# Altium project TS4994_Add_on_v1.PrjPcb
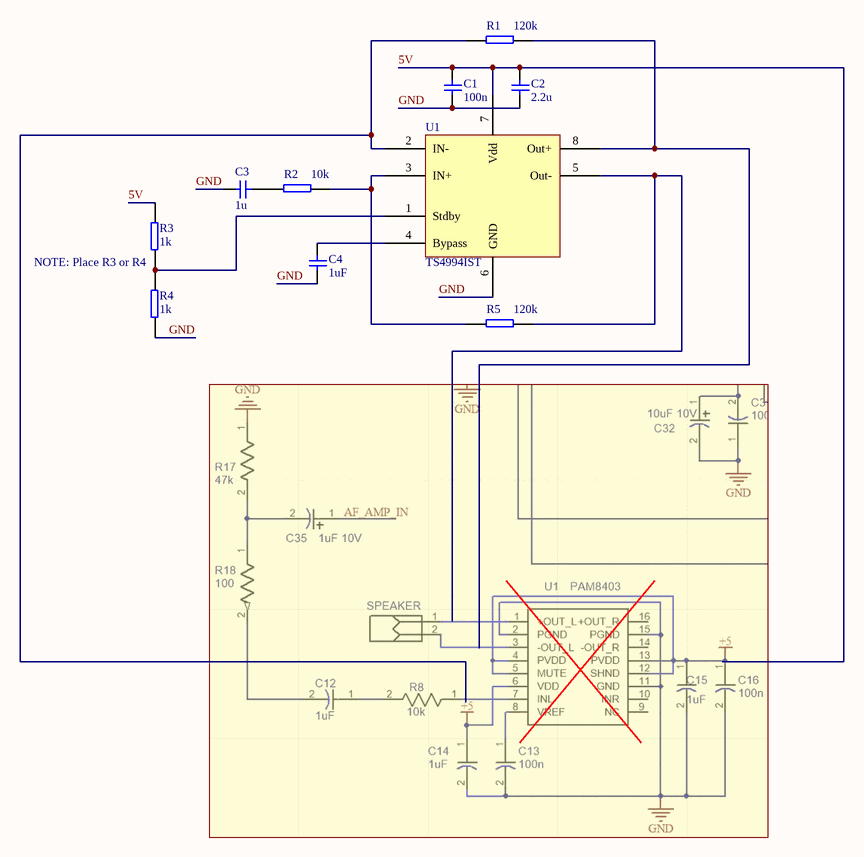
[diagram p0: TS4994_Add_on_v1.SchDoc]
1 sheet, 10 parts. Net scope: hierarchical (ports join the sheet entries above them; power ports are global).
Board file: TS4994_Add_on_v1.PcbDoc

## Sheet TS4994_Add_on_v1.SchDoc
size A4

### Parts
C1  value 100n  [0805S]  (hidden comment: C0805)
C2  value 2.2u  [0805S]  (hidden comment: C0805)
C3  value 1u  [0805S]  (hidden comment: C0805)
C4  value 1uF  [0805S]  (hidden comment: C0805)
R1  value 120k  [0805S]  (hidden comment: R0805)
R2  value 10k  [0805S]  (hidden comment: R0805)
R3  value 1k  [0805S]  (hidden comment: R0805)
R4  value 1k  [0805S]  (hidden comment: R0805)
R5  value 120k  [0805S]  (hidden comment: R0805)
U1  TS4994IST  [MSOP8]

### Nets
5V: C1.2 C2.2 R3.2 U1.7(Vdd)
GND: C1.1 C2.1 C3.1 C4.1 R4.1 U1.6(GND)
NetC3_2: C3.2 R2.1
NetC4_2: C4.2 U1.4(Bypass)
NetR1_1: R1.1 U1.2(IN-)
NetR1_2: R1.2 U1.8(Out+)
NetR2_2: R2.2 R5.1 U1.3(IN+)
NetR3_1: R3.1 R4.2 U1.1(Stdby)
NetR5_2: R5.2 U1.5(Out-)

### Notes on the sheet
- (near R3) NOTE: Place R3 or R4

### Library data of the parts
C1-C4 = C0805: Capacitor
R1-R5 = R0805: Resistor